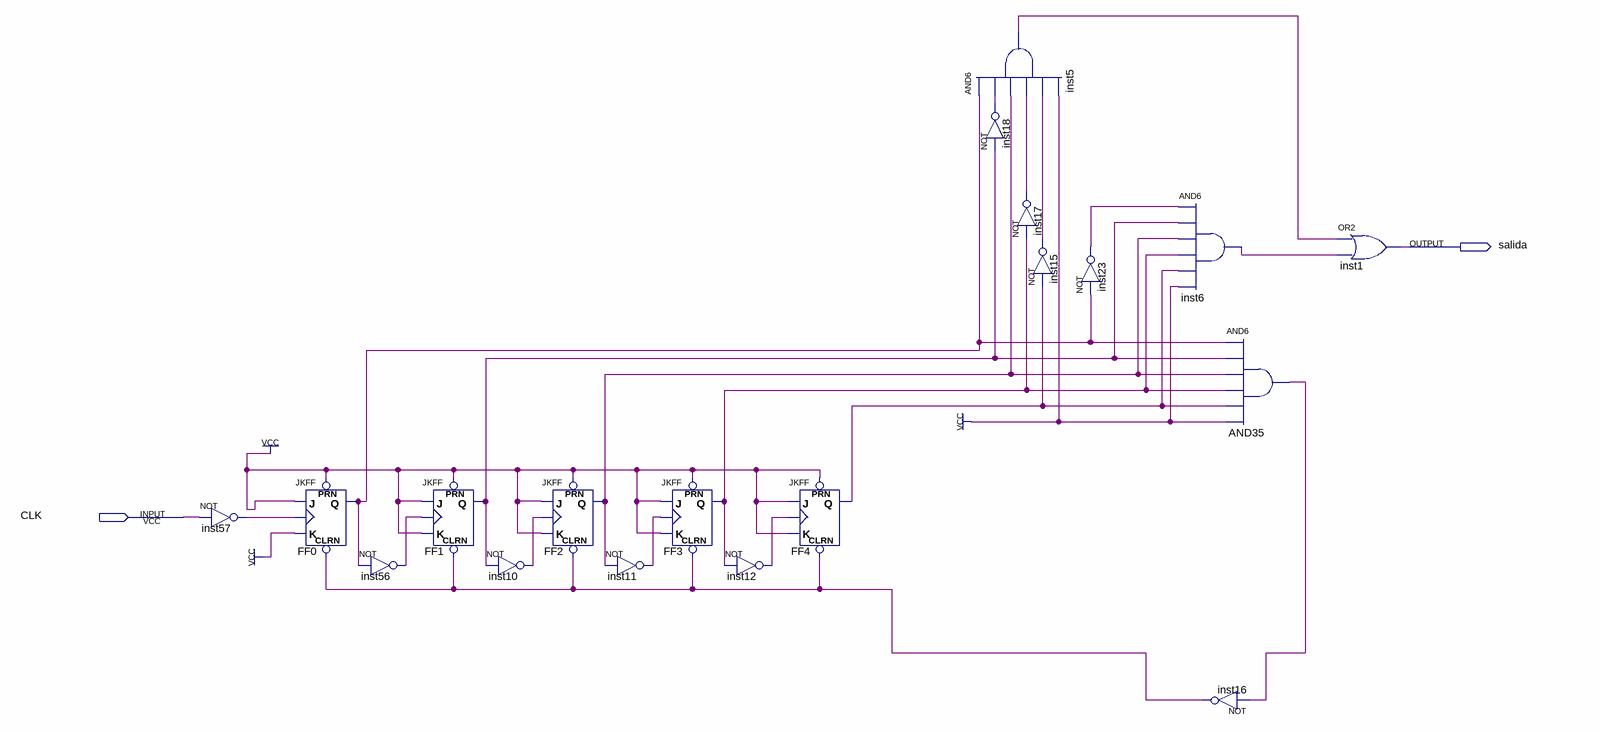
[diagram p0: schematic sheet]
// Quartus schematic contadorUnico.bdf as structural Verilog: 19 symbols, 2 pins
module contadorUnico (
  input  CLK,
  output salida
);

  wire AND35_out, FF0_q, FF1_q, FF2_q, FF3_q, FF4_q, inst5_out, inst6_out, inst10_out, inst11_out,
       inst12_out, inst15_out, inst16_out, inst17_out, inst18_out, inst23_out, inst56_out, inst57_out;

  not inst57 (inst57_out, CLK);
  JKFF FF0 (.PRN(1'b1), .CLRN(inst16_out), .K(1'b1), .J(1'b1), .CLK(inst57_out), .Q(FF0_q));
  not inst56 (inst56_out, FF0_q);
  JKFF FF1 (.PRN(1'b1), .CLRN(inst16_out), .K(1'b1), .J(1'b1), .CLK(inst56_out), .Q(FF1_q));
  not inst10 (inst10_out, FF1_q);
  JKFF FF2 (.PRN(1'b1), .CLRN(inst16_out), .K(1'b1), .J(1'b1), .CLK(inst10_out), .Q(FF2_q));
  not inst11 (inst11_out, FF2_q);
  JKFF FF3 (.PRN(1'b1), .CLRN(inst16_out), .K(1'b1), .J(1'b1), .CLK(inst11_out), .Q(FF3_q));
  not inst12 (inst12_out, FF3_q);
  JKFF FF4 (.PRN(1'b1), .CLRN(inst16_out), .K(1'b1), .J(1'b1), .CLK(inst12_out), .Q(FF4_q));
  and inst5 (inst5_out, FF0_q, inst18_out, FF2_q, inst17_out, inst15_out, 1'b1);
  not inst18 (inst18_out, FF1_q);
  not inst17 (inst17_out, FF3_q);
  not inst15 (inst15_out, FF4_q);
  not inst23 (inst23_out, FF0_q);
  and inst6 (inst6_out, inst23_out, FF1_q, FF2_q, FF3_q, FF4_q, 1'b1);
  not inst16 (inst16_out, AND35_out);
  and AND35 (AND35_out, FF0_q, FF1_q, FF2_q, FF3_q, FF4_q, 1'b1);
  or inst1 (salida, inst5_out, inst6_out);
endmodule
